# Altium schematic sheet Sheet1.SchDoc
size A4
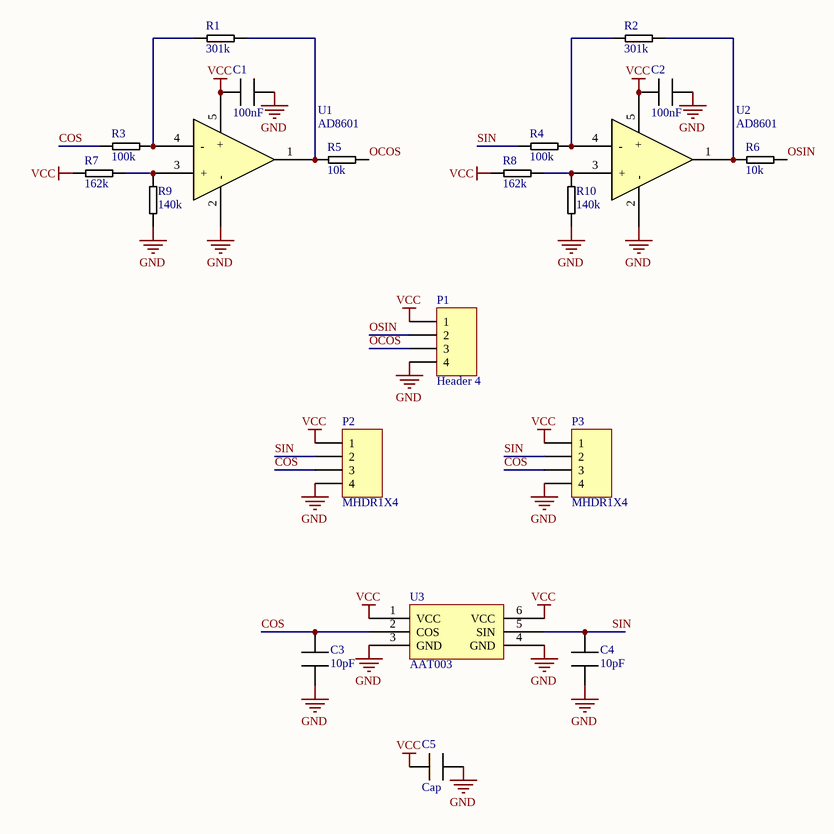
[diagram p0: Sheet1.SchDoc]

## Parts
C1  100nF  [0603]
C2  100nF  [0603]
C3  10pF  [0603]
C4  10pF  [0603]
C5  Cap  [0603]
P1  Header 4  [HDR1X4]
P2  MHDR1X4  [MHDR1X4]
P3  MHDR1X4  [MHDR1X4]
R1  301k  [0603]
R2  301k  [0603]
R3  100k  [0603]
R4  100k  [0603]
R5  10k  [0603]
R6  10k  [0603]
R7  162k  [0603]
R8  162k  [0603]
R9  140k  [0603]
R10  140k  [0603]
U1  AD8601  [SOT23-5]
U2  AD8601  [SOT23-5]
U3  AAT003  [PSON65P250X80_HS-7M]

## Nets
GND: C1.2 C2.2 C3.1 C4.1 C5.2 P1.4 P2.4 P3.4 R9.1 R10.1 U1.2(-) U2.2(-) U3.3(GND) U3.4(GND)
VCC: C1.1 C2.1 C5.1 P1.1 P2.1 P3.1 R7.1 R8.1 U1.5(+) U2.5(+) U3.1(VCC) U3.6(VCC)
COS: C3.2 P2.3 P3.3 R3.1 U3.2(COS)
OCOS: P1.3 R5.2
OSIN: P1.2 R6.2
SIN: C4.2 P2.2 P3.2 R4.1 U3.5(SIN)
NetR1_1: R1.1 R3.2 U1.4(-)
NetR1_2: R1.2 R5.1 U1.1
NetR2_1: R2.1 R4.2 U2.4(-)
NetR2_2: R2.2 R6.1 U2.1
NetR7_2: R7.2 R9.2 U1.3(+)
NetR8_2: R8.2 R10.2 U2.3(+)

## Library data of the parts
C1-C4 = Cap
P1 = Header 4: Header, 4-Pin; LatestRevisionDate: 17-Jul-2002; LatestRevisionNote: Re-released for DXP Platform.; Publisher: Altium Limited
P2 P3 = MHDR1X4: Header, 4-Pin; LatestRevisionDate: 17-Jul-2002; LatestRevisionNote: Re-released for DXP Platform.; Publisher: Altium Limited
R1-R10 = Res